# EAGLE schematic BigFish_Rev1 (EAGLE 7.7.0)

## Sheet 1 of 6: Pots & analog mux
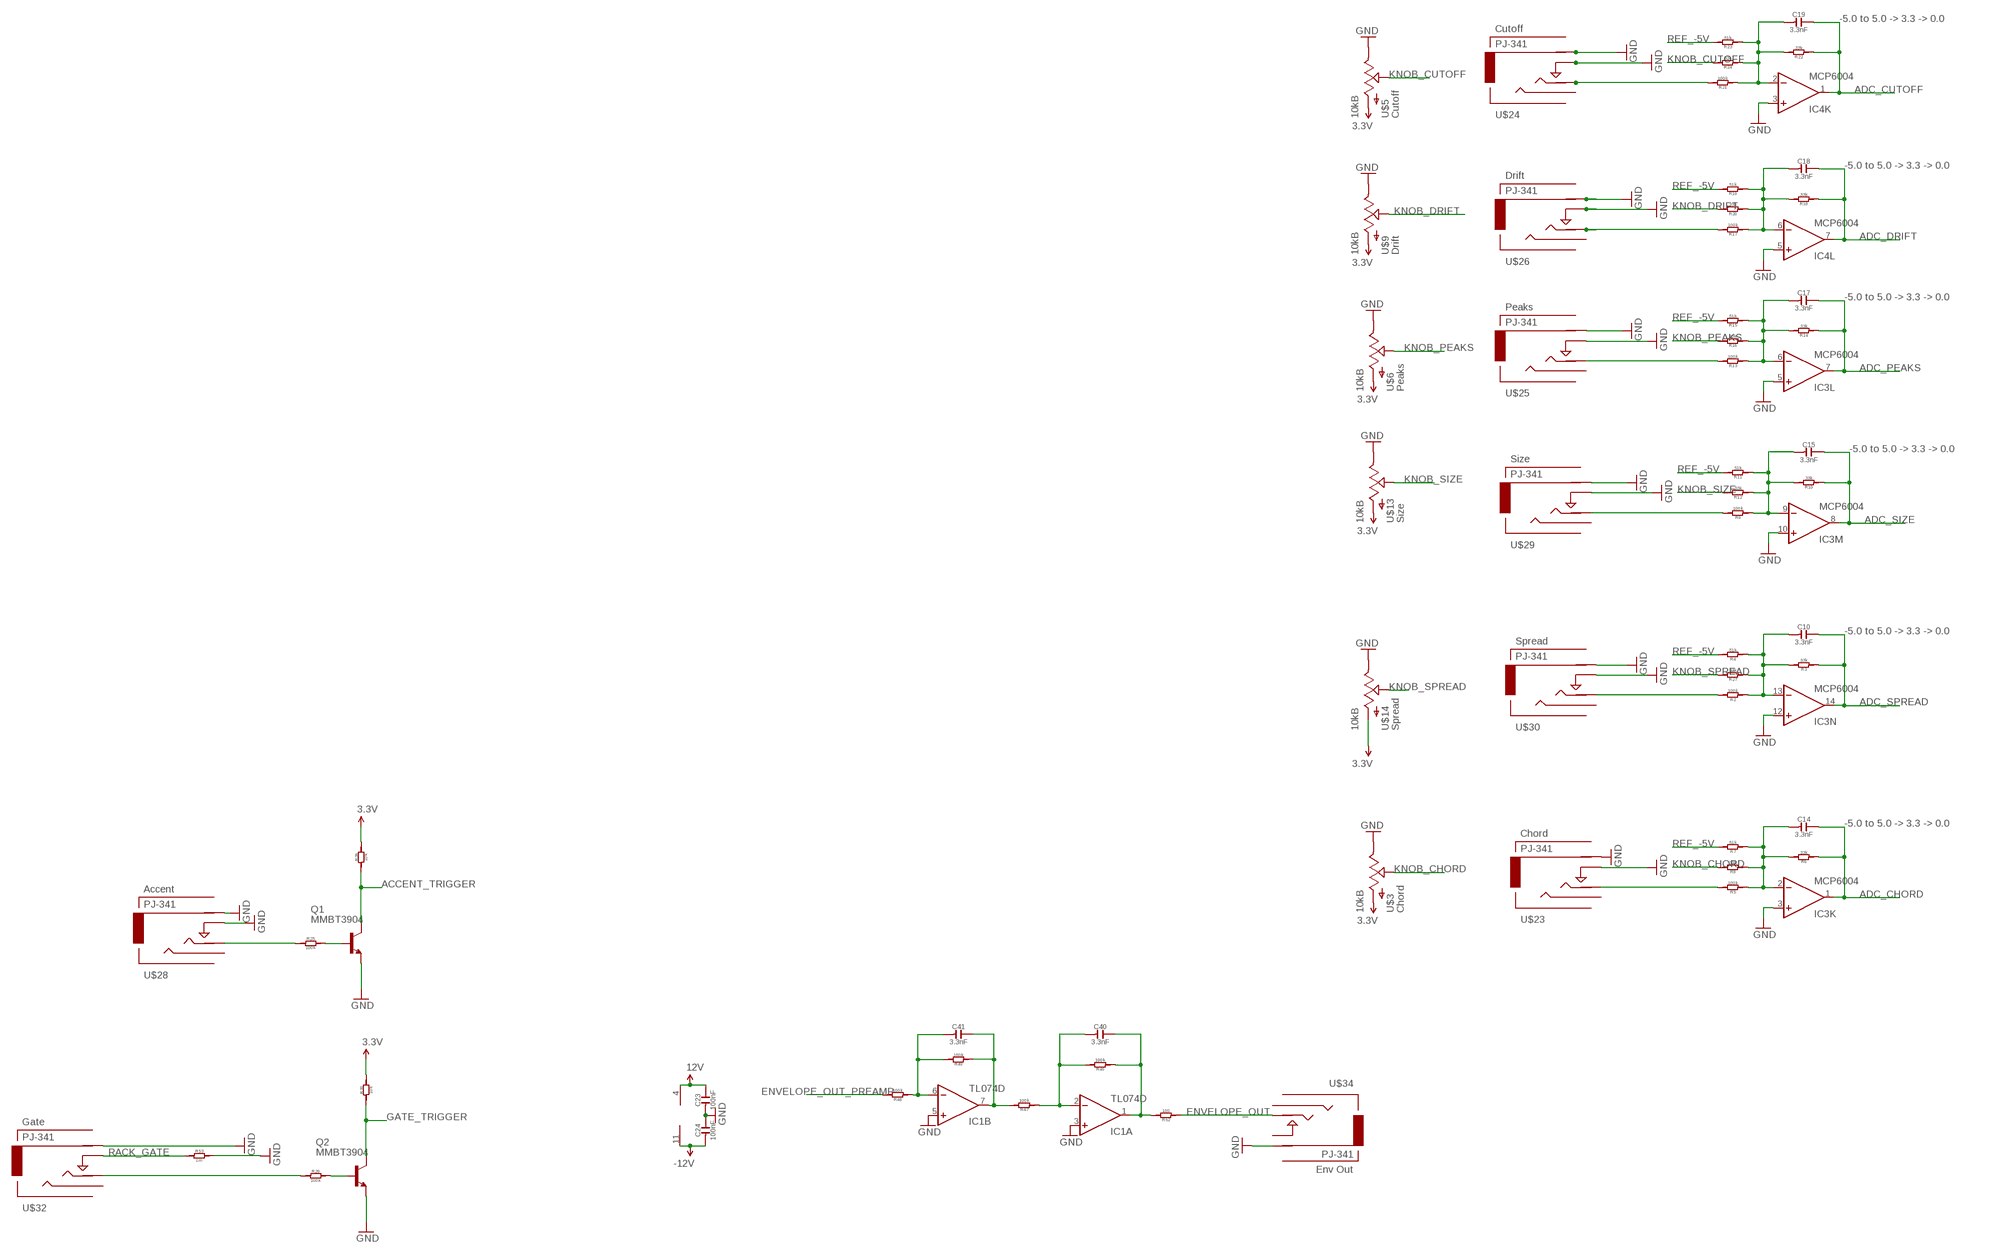
[diagram p0: schematic, sheet 1, part 1 of 2]
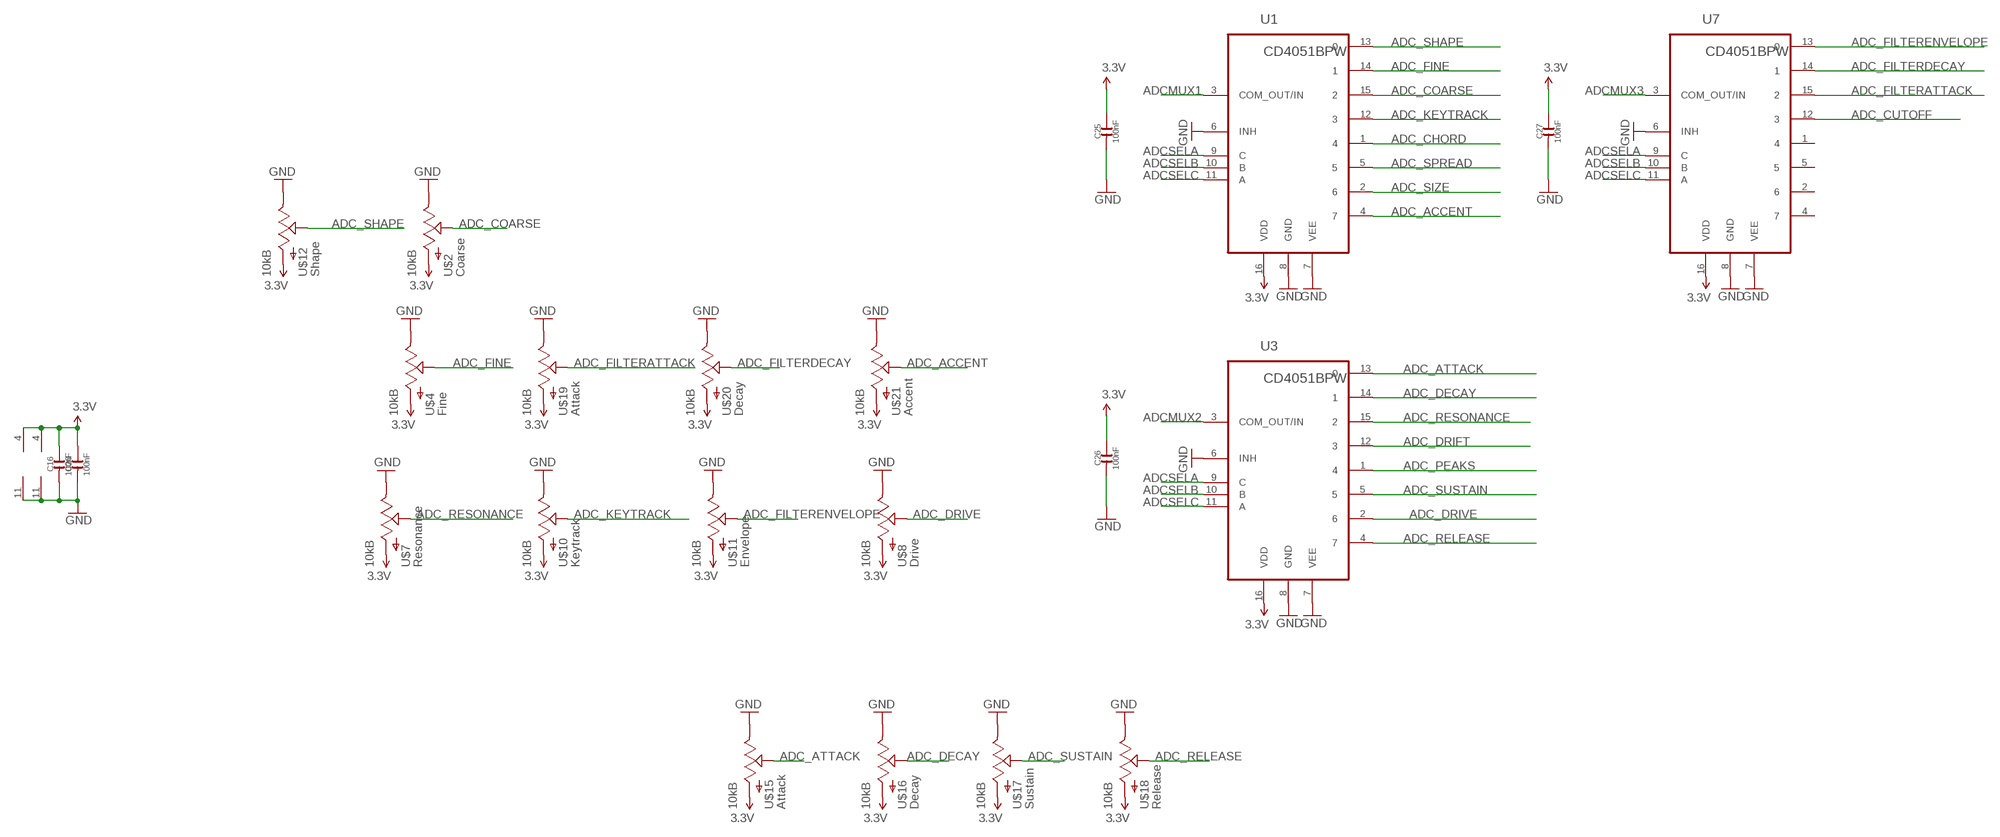
[diagram p1: schematic, sheet 1, part 2 of 2]

### Parts
C10  3.3nF  C-0603  [C0603]
C14  3.3nF  C-0603  [C0603]
C15  3.3nF  C-0603  [C0603]
C16  100nF  C-0603  [C0603]
C17  3.3nF  C-0603  [C0603]
C18  3.3nF  C-0603  [C0603]
C19  3.3nF  C-0603  [C0603]
C20  100nF  C-0603  [C0603]
C23  100nF  C-0603  [C0603]
C24  100nF  C-0603  [C0603]
C25  100nF  C-0603  [C0603]
C26  100nF  C-0603  [C0603]
C27  100nF  C-0603  [C0603]
C40  3.3nF  C-0603  [C0603]
C41  3.3nF  C-0603  [C0603]
IC1  TL074D  [SO14]
IC3  MCP6004  [SO14]
IC4  MCP6004  [SO14]
Q1  MMBT3904  MMBT3904LT1-NPN-SOT23-BEC  [SOT23-BEC]
Q2  MMBT3904  MMBT3904LT1-NPN-SOT23-BEC  [SOT23-BEC]
R2  100k  R-0603  [R0603]
R3  33k  R-0603  [R0603]
R4  51k  R-0603  [R0603]
R5  100k  R-0603  [R0603]
R6  33k  R-0603  [R0603]
R7  51k  R-0603  [R0603]
R8  33k  R-0603  [R0603]
R9  100k  R-0603  [R0603]
R10  33k  R-0603  [R0603]
R11  51k  R-0603  [R0603]
R12  33k  R-0603  [R0603]
R13  100k  R-0603  [R0603]
R14  33k  R-0603  [R0603]
R15  51k  R-0603  [R0603]
R16  33k  R-0603  [R0603]
R17  100k  R-0603  [R0603]
R18  33k  R-0603  [R0603]
R19  51k  R-0603  [R0603]
R20  33k  R-0603  [R0603]
R21  100k  R-0603  [R0603]
R22  33k  R-0603  [R0603]
R23  51k  R-0603  [R0603]
R24  33k  R-0603  [R0603]
R25  100k  R-0603  [R0603]
R27  33k  R-0603  [R0603]
R28  10k  R-0603  [R0603]
R29  100k  R-0603  [R0603]
R30  10k  R-0603  [R0603]
R46  100k  R-0603  [R0603]
R47  100k  R-0603  [R0603]
R48  100k  R-0603  [R0603]
R49  100k  R-0603  [R0603]
R52  100  R-0603  [R0603]
R53  1m  R-0603  [R0603]
U1  CD4051BPW  [SOP65P640X120-16N]
U3  CD4051BPW  [SOP65P640X120-16N]
U7  CD4051BPW  [SOP65P640X120-16N]
U$2  10kB  POTZEPHPOT  [OG-POTS_ALPS_POT_VERTICAL]
U$3  10kB  POTZEPHPOT  [OG-POTS_ALPS_POT_VERTICAL]
U$4  10kB  POTZEPHPOT  [OG-POTS_ALPS_POT_VERTICAL]
U$5  10kB  POTZEPHPOT  [OG-POTS_ALPS_POT_VERTICAL]
U$6  10kB  POTZEPHPOT  [OG-POTS_ALPS_POT_VERTICAL]
U$7  10kB  POTZEPHPOT  [OG-POTS_ALPS_POT_VERTICAL]
U$8  10kB  POTZEPHPOT  [OG-POTS_ALPS_POT_VERTICAL]
U$9  10kB  POTZEPHPOT  [OG-POTS_ALPS_POT_VERTICAL]
U$10  10kB  POTZEPHPOT  [OG-POTS_ALPS_POT_VERTICAL]
U$11  10kB  POTZEPHPOT  [OG-POTS_ALPS_POT_VERTICAL]
U$12  10kB  POTZEPHPOT  [OG-POTS_ALPS_POT_VERTICAL]
U$13  10kB  POTZEPHPOT  [OG-POTS_ALPS_POT_VERTICAL]
U$14  10kB  POTZEPHPOT  [OG-POTS_ALPS_POT_VERTICAL]
U$15  10kB  POTZEPHPOT  [OG-POTS_ALPS_POT_VERTICAL]
U$16  10kB  POTZEPHPOT  [OG-POTS_ALPS_POT_VERTICAL]
U$17  10kB  POTZEPHPOT  [OG-POTS_ALPS_POT_VERTICAL]
U$18  10kB  POTZEPHPOT  [OG-POTS_ALPS_POT_VERTICAL]
U$19  10kB  POTZEPHPOT  [OG-POTS_ALPS_POT_VERTICAL]
U$20  10kB  POTZEPHPOT  [OG-POTS_ALPS_POT_VERTICAL]
U$21  10kB  POTZEPHPOT  [OG-POTS_ALPS_POT_VERTICAL]
U$23  PJ-341  AUDIO-JACKINPUT  [3.5MM-JACK-SWITCH-13MM-INPUT]
U$24  PJ-341  AUDIO-JACKINPUT  [3.5MM-JACK-SWITCH-13MM-INPUT]
U$25  PJ-341  AUDIO-JACKINPUT  [3.5MM-JACK-SWITCH-13MM-INPUT]
U$26  PJ-341  AUDIO-JACKINPUT  [3.5MM-JACK-SWITCH-13MM-INPUT]
U$28  PJ-341  AUDIO-JACKINPUT  [3.5MM-JACK-SWITCH-13MM-INPUT]
U$29  PJ-341  AUDIO-JACKINPUT  [3.5MM-JACK-SWITCH-13MM-INPUT]
U$30  PJ-341  AUDIO-JACKINPUT  [3.5MM-JACK-SWITCH-13MM-INPUT]
U$32  PJ-341  AUDIO-JACKINPUT  [3.5MM-JACK-SWITCH-13MM-INPUT]
U$34  PJ-341  AUDIO-JACKOUTPUT  [3.5MM-JACK-SWITCH-13MM-OUTPUT]

### Nets
3.3V [mediumpower]: C16.2 C20.2 C25.2 C26.2 C27.2 IC3.4(O:V+) IC4.4(O:V+) R28.2 R30.2 U1.16(VDD) U3.16(VDD) U7.16(VDD) U$2.P$3(A) U$3.P$3(A) U$4.P$3(A) U$5.P$3(A) U$6.P$3(A) U$7.P$3(A) U$8.P$3(A) U$9.P$3(A) U$10.P$3(A) U$11.P$3(A) U$12.P$3(A) U$13.P$3(A) U$14.P$3(A) U$15.P$3(A) U$16.P$3(A) U$17.P$3(A) U$18.P$3(A) U$19.P$3(A) U$20.P$3(A) U$21.P$3(A) ; also sheet 2,3,5,6
12V [heavypower]: C23.2 IC1.4(P:V+) ; also sheet 3,5
-12V [heavypower]: C24.1 IC1.11(P:V-) ; also sheet 3,5
ACCENT_TRIGGER: Q1.C R28.1 ; also sheet 2
ADC_ACCENT: U1.4 U$21.P$2(S)
ADC_ATTACK: U3.13 U$15.P$2(S)
ADC_CHORD: C14.2 IC3.1(K:OUT) R6.1 U1.1
ADC_COARSE: U1.15 U$2.P$2(S)
ADC_CUTOFF: C19.2 IC4.1(K:OUT) R22.1 U7.12
ADC_DECAY: U3.14 U$16.P$2(S)
ADC_DRIFT: C18.2 IC4.7(L:OUT) R18.1 U3.12
ADC_DRIVE: U3.2 U$8.P$2(S)
ADC_FILTERATTACK: U7.15 U$19.P$2(S)
ADC_FILTERDECAY: U7.14 U$20.P$2(S)
ADC_FILTERENVELOPE: U7.13 U$11.P$2(S)
ADC_FINE: U1.14 U$4.P$2(S)
ADC_KEYTRACK: U1.12 U$10.P$2(S)
ADC_PEAKS: C17.2 IC3.7(L:OUT) R14.1 U3.1
ADC_RELEASE: U3.4 U$18.P$2(S)
ADC_RESONANCE: U3.15 U$7.P$2(S)
ADC_SHAPE: U1.13 U$12.P$2(S)
ADC_SIZE: C15.2 IC3.8(M:OUT) R10.1 U1.2
ADC_SPREAD: C10.2 IC3.14(N:OUT) R3.1 U1.5
ADC_SUSTAIN: U3.5 U$17.P$2(S)
ADCMUX1: U1.3(COM_OUT/IN) ; also sheet 2
ADCMUX2: U3.3(COM_OUT/IN) ; also sheet 2
ADCMUX3: U7.3(COM_OUT/IN) ; also sheet 2
ADCSELA: U1.9(C) U3.9(C) U7.9(C) ; also sheet 2
ADCSELB: U1.10(B) U3.10(B) U7.10(B) ; also sheet 2
ADCSELC: U1.11(A) U3.11(A) U7.11(A) ; also sheet 2
ENVELOPE_OUT: R52.1 U$34.TIP@3(TIP)
ENVELOPE_OUT_PREAMP: R48.2 ; also sheet 2
GATE_TRIGGER: Q2.C R30.1 ; also sheet 2
GND: C16.1 C20.1 C23.1 C24.2 C25.1 C26.1 C27.1 IC1.3(A:+IN) IC1.5(B:+IN) IC3.3(K:+IN) IC3.5(L:+IN) IC3.10(M:+IN) IC3.11(O:V-) IC3.12(N:+IN) IC4.3(K:+IN) IC4.5(L:+IN) IC4.11(O:V-) Q1.E Q2.E R53.2 U1.6(INH) U1.7(VEE) U1.8(GND) U3.6(INH) U3.7(VEE) U3.8(GND) U7.6(INH) U7.7(VEE) U7.8(GND) U$2.P$1(E) U$3.P$1(E) U$4.P$1(E) U$5.P$1(E) U$6.P$1(E) U$7.P$1(E) U$8.P$1(E) U$9.P$1(E) U$10.P$1(E) U$11.P$1(E) U$12.P$1(E) U$13.P$1(E) U$14.P$1(E) U$15.P$1(E) U$16.P$1(E) U$17.P$1(E) U$18.P$1(E) U$19.P$1(E) U$20.P$1(E) U$21.P$1(E) U$23.RING@3(RING) U$23.SWITCH@3(SWITCH) U$24.RING@3(RING) U$24.SWITCH@3(SWITCH) U$25.RING@3(RING) U$25.SWITCH@3(SWITCH) U$26.RING@3(RING) U$26.SWITCH@3(SWITCH) U$28.RING@3(RING) U$28.SWITCH@3(SWITCH) U$29.RING@3(RING) U$29.SWITCH@3(SWITCH) U$30.RING@3(RING) U$30.SWITCH@3(SWITCH) U$32.RING@3(RING) U$34.RING@3(RING) ; also sheet 2,3,5,6
KNOB_CHORD: R8.2 U$3.P$2(S)
KNOB_CUTOFF: R24.2 U$5.P$2(S)
KNOB_DRIFT: R20.2 U$9.P$2(S)
KNOB_PEAKS: R16.2 U$6.P$2(S)
KNOB_SIZE: R12.2 U$13.P$2(S)
KNOB_SPREAD: R27.2 U$14.P$2(S)
N$3: R17.2 U$26.TIP@3(TIP)
N$4: C18.1 IC4.6(L:-IN) R17.1 R18.2 R19.1 R20.1
N$5: R21.2 U$24.TIP@3(TIP)
N$6: R2.2 U$30.TIP@3(TIP)
N$7: C19.1 IC4.2(K:-IN) R21.1 R22.2 R23.1 R24.1
N$8: C10.1 IC3.13(N:-IN) R2.1 R3.2 R4.1 R27.1
N$9: Q1.B R25.2
N$10: R25.1 U$28.TIP@3(TIP)
N$11: Q2.B R29.2
N$12: R5.2 U$23.TIP@3(TIP)
N$14: C14.1 IC3.2(K:-IN) R5.1 R6.2 R7.1 R8.1
N$15: R9.2 U$29.TIP@3(TIP)
N$16: C15.1 IC3.9(M:-IN) R9.1 R10.2 R11.1 R12.1
N$17: R13.2 U$25.TIP@3(TIP)
N$18: C17.1 IC3.6(L:-IN) R13.1 R14.2 R15.1 R16.1
N$19: R29.1 U$32.TIP@3(TIP)
N$47: C40.2 IC1.1(A:OUT) R46.1 R52.2
N$54: C41.1 IC1.6(B:-IN) R48.1 R49.2
N$55: C41.2 IC1.7(B:OUT) R47.2 R49.1
N$56: C40.1 IC1.2(A:-IN) R46.2 R47.1
RACK_GATE: R53.1 U$32.SWITCH@3(SWITCH) ; also sheet 3
REF_-5V: R4.2 R7.2 R11.2 R15.2 R19.2 R23.2 ; also sheet 3,5
Unconnected: U7.1 U7.2 U7.4 U7.5 U$23.SECOND@3(SECOND) U$24.SECOND@3(SECOND) U$25.SECOND@3(SECOND) U$26.SECOND@3(SECOND) U$28.SECOND@3(SECOND) U$29.SECOND@3(SECOND) U$30.SECOND@3(SECOND) U$32.SECOND@3(SECOND) U$34.SECOND@3(SECOND) U$34.SWITCH@3(SWITCH)

### Notes on the sheet
- -5.0 to 5.0 -> 3.3 -> 0.0
- -5.0 to 5.0 -> 3.3 -> 0.0
- -5.0 to 5.0 -> 3.3 -> 0.0
- -5.0 to 5.0 -> 3.3 -> 0.0
- -5.0 to 5.0 -> 3.3 -> 0.0
- -5.0 to 5.0 -> 3.3 -> 0.0

## Sheet 2 of 6: MCU
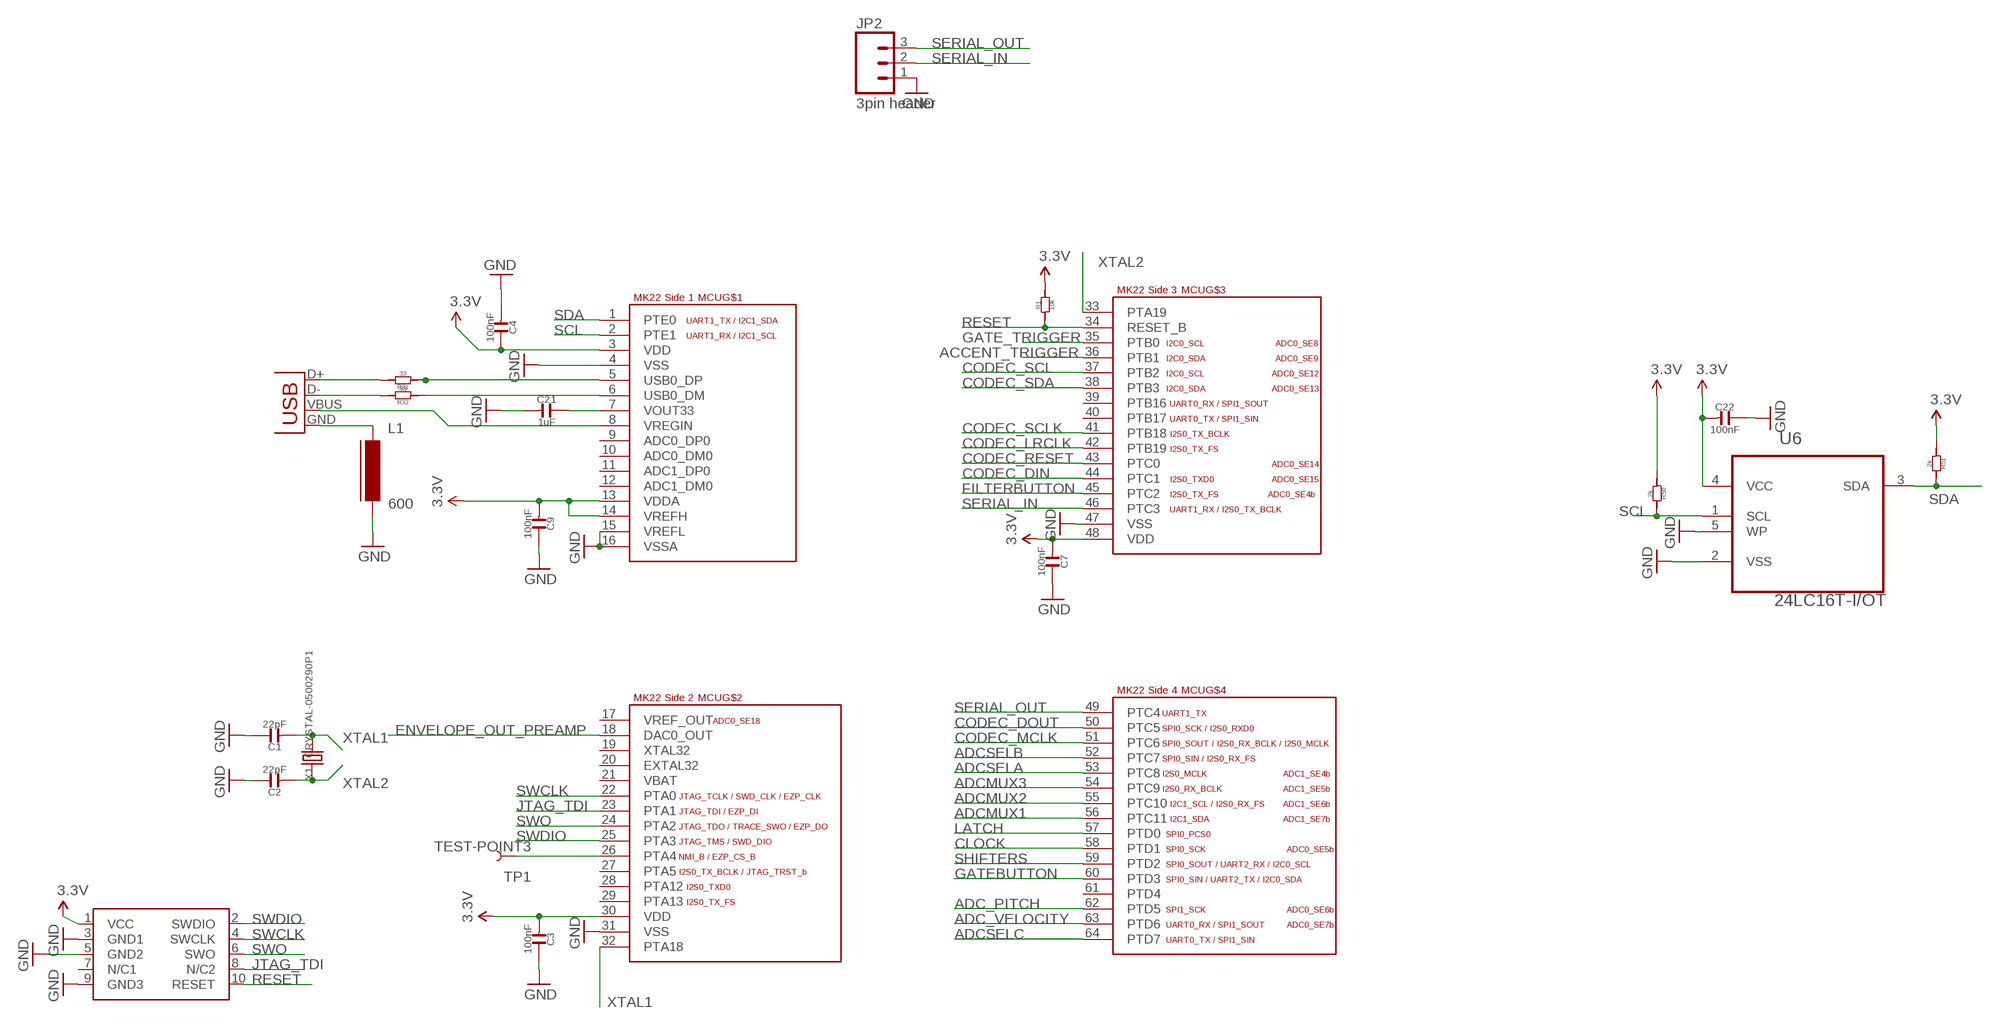
[diagram p2: schematic, sheet 2]

### Parts
C1  22pF  C-0603  [C0603]
C2  22pF  C-0603  [C0603]
C3  100nF  C-0603  [C0603]
C4  100nF  C-0603  [C0603]
C7  100nF  C-0603  [C0603]
C9  100nF  C-0603  [C0603]
C21  1uF  C-0603  [C0603]
C22  100nF  C-0603  [C0603]
JP1  USBPTH-VERTICAL  [USB-B-PTH-VERTICAL]
JP2  3pin header  M03PTH  [1X03]
L1  600  FERRITE-0603  [FB603]
MCU  MK22_120_TQFP64  [MK22_TQFP64]
R1  10k  R-0603  [R0603]
R31  33  R-0603  [R0603]
R32  33  R-0603  [R0603]
R50  2k  R-0603  [R0603]
R51  2k  R-0603  [R0603]
SWD1  CORTEX_SWD  [M50-3600542]
TP1  TEST-POINT3  [PAD.03X.03]
U6  24LC16T-I/OT  24LC00T-I/OT  [SOT95P290X145-5N]
X1  CRYSTAL-0500290P1  [2P-SMD-5.0X3.2]

### Nets
3.3V [mediumpower]: C3.1 C4.2 C7.1 C9.1 C22.1 MCU.3(VDD) MCU.13(VDDA) MCU.14(VREFH) MCU.30(VDD) MCU.48(VDD) R1.2 R50.1 R51.1 SWD1.1(VCC) U6.4(VCC) ; also sheet 1,3,5,6
ACCENT_TRIGGER: MCU.36(PTB1) ; also sheet 1
ADC_PITCH: MCU.62(PTD5) ; also sheet 5
ADC_VELOCITY: MCU.63(PTD6) ; also sheet 5
ADCMUX1: MCU.56(PTC11) ; also sheet 1
ADCMUX2: MCU.55(PTC10) ; also sheet 1
ADCMUX3: MCU.54(PTC9) ; also sheet 1
ADCSELA: MCU.53(PTC8) ; also sheet 1
ADCSELB: MCU.52(PTC7) ; also sheet 1
ADCSELC: MCU.64(PTD7) ; also sheet 1
CLOCK: MCU.58(PTD1) ; also sheet 6
CODEC_DIN: MCU.44(PTC1) ; also sheet 5
CODEC_DOUT: MCU.50(PTC5) ; also sheet 5
CODEC_LRCLK: MCU.42(PTB19) ; also sheet 5
CODEC_MCLK: MCU.51(PTC6) ; also sheet 5
CODEC_RESET: MCU.43(PTC0) ; also sheet 5
CODEC_SCL: MCU.37(PTB2) ; also sheet 5
CODEC_SCLK: MCU.41(PTB18) ; also sheet 5
CODEC_SDA: MCU.38(PTB3) ; also sheet 5
ENVELOPE_OUT_PREAMP: MCU.18(DAC0_OUT) ; also sheet 1
FILTERBUTTON: MCU.45(PTC2) ; also sheet 6
GATE_TRIGGER: MCU.35(PTB0) ; also sheet 1
GATEBUTTON: MCU.60(PTD3) ; also sheet 6
GND: C1.2 C2.2 C3.2 C4.1 C7.2 C9.2 C21.1 C22.2 JP2.1 L1.2 MCU.4(VSS) MCU.15(VREFL) MCU.16(VSSA) MCU.31(VSS) MCU.47(VSS) SWD1.3(GND1) SWD1.5(GND2) SWD1.9(GND3) U6.2(VSS) U6.5(WP) ; also sheet 1,3,5,6
JTAG_TDI: MCU.23(PTA1) SWD1.8(N/C2)
LATCH: MCU.57(PTD0) ; also sheet 6
N$20: C21.2 MCU.7(VOUT33)
N$21: JP1.D+ R31.2
N$22: JP1.D- R32.2
N$23 [mediumpower]: JP1.VBUS MCU.8(VREGIN)
N$24: MCU.5(USB0_DP) R31.1
N$25: MCU.6(USB0_DM) R32.1
N$26 [heavypower]: JP1.GND L1.1
N$57: MCU.26(PTA4) TP1.P$1
RESET: MCU.34(RESET_B) R1.1 SWD1.10(RESET)
SCL: MCU.2(PTE1) R50.2 U6.1(SCL)
SDA: MCU.1(PTE0) R51.2 U6.3(SDA)
SERIAL_IN: JP2.2 MCU.46(PTC3)
SERIAL_OUT: JP2.3 MCU.49(PTC4)
SHIFTERS: MCU.59(PTD2) ; also sheet 6
SWCLK: MCU.22(PTA0) SWD1.4(SWCLK)
SWDIO: MCU.25(PTA3) SWD1.2(SWDIO)
SWO: MCU.24(PTA2) SWD1.6(SWO)
XTAL1: C1.1 MCU.32(PTA18) X1.2
XTAL2: C2.1 MCU.33(PTA19) X1.1
Unconnected: MCU.9(ADC0_DP0) MCU.10(ADC0_DM0) MCU.11(ADC1_DP0) MCU.12(ADC1_DM0) MCU.17(VREF_OUT) MCU.19(XTAL32) MCU.20(EXTAL32) MCU.21(VBAT) MCU.27(PTA5) MCU.28(PTA12) MCU.29(PTA13) MCU.39(PTB16) MCU.40(PTB17) MCU.61(PTD4) SWD1.7(N/C1)

## Sheet 3 of 6: Power
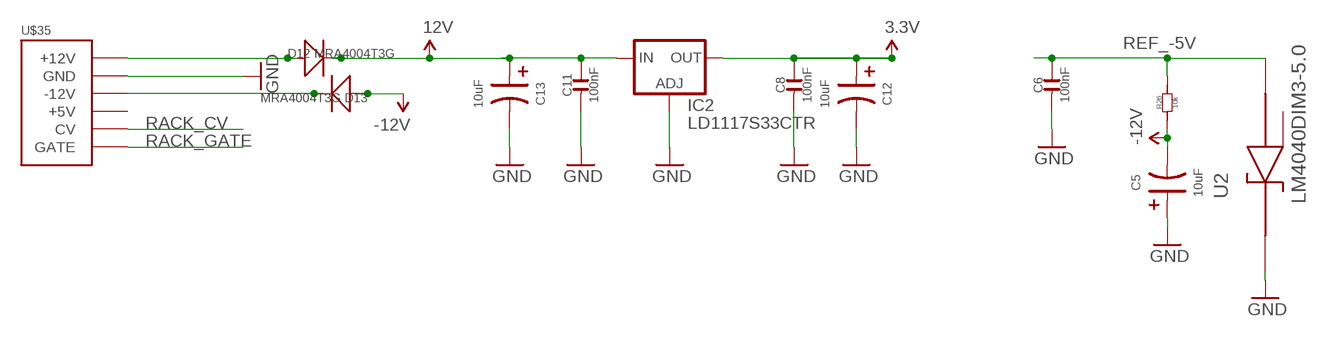
[diagram p3: schematic, sheet 3]

### Parts
C5  10uF  C-POLAR-A  [AVX-A]
C6  100nF  C-0603  [C0603]
C8  100nF  C-0603  [C0603]
C11  100nF  C-0603  [C0603]
C12  10uF  C-POLAR-A  [AVX-A]
C13  10uF  C-POLAR-A  [AVX-A]
D12  MRA4004T3G  D-SMA  [DO-214AC]
D13  MRA4004T3G  D-SMA  [DO-214AC]
IC2  LD1117S33CTR  LD1117AS33TR  [SOT223]
R26  10k  R-0603  [R0603]
U2  LM4040DIM3-5.0  [SOT95P237X112-3N]
U$35  POWERSMT  [2X08_SMT_HEADER]

### Nets
3.3V [mediumpower]: C8.2 C12.+ IC2.2(OUT) IC2.4(OUT) ; also sheet 1,2,5,6
12V [heavypower]: C11.2 C13.+ D12.2(-) IC2.3(IN) ; also sheet 1,5
-12V [heavypower]: C5.- D13.1(+) R26.1 ; also sheet 1,5
GND: C5.+ C6.1 C8.1 C11.1 C12.- C13.- IC2.1(ADJ) U2.1(CATHODE) U$35.3(GND) U$35.4(GND) U$35.5(GND) U$35.6(GND) U$35.7(GND) U$35.8(GND) ; also sheet 1,2,5,6
N$13 [heavypower]: D12.1(+) U$35.9(+12V) U$35.10(+12V)
N$64 [heavypower]: D13.2(-) U$35.1(-12V) U$35.2(-12V)
RACK_CV: U$35.13(CV) U$35.14(CV) ; also sheet 5
RACK_GATE: U$35.15(GATE) U$35.16(GATE) ; also sheet 1
REF_-5V: C6.2 R26.2 U2.2(ANODE) ; also sheet 1,5
Unconnected: U2.3(NC) U$35.11(+5V) U$35.12(+5V)

## Sheet 4 of 6: Cosmetic
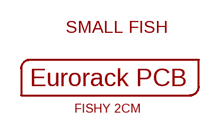
[diagram p4: schematic, sheet 4]

### Parts
U$1  EURORACK_PCB24HP  [EURORACK24HPPCB]
U$45  FISH2CM  [FISH]
U$49  FISH_SMALL  [FISH_SMALL]

## Sheet 5 of 6: CODEC
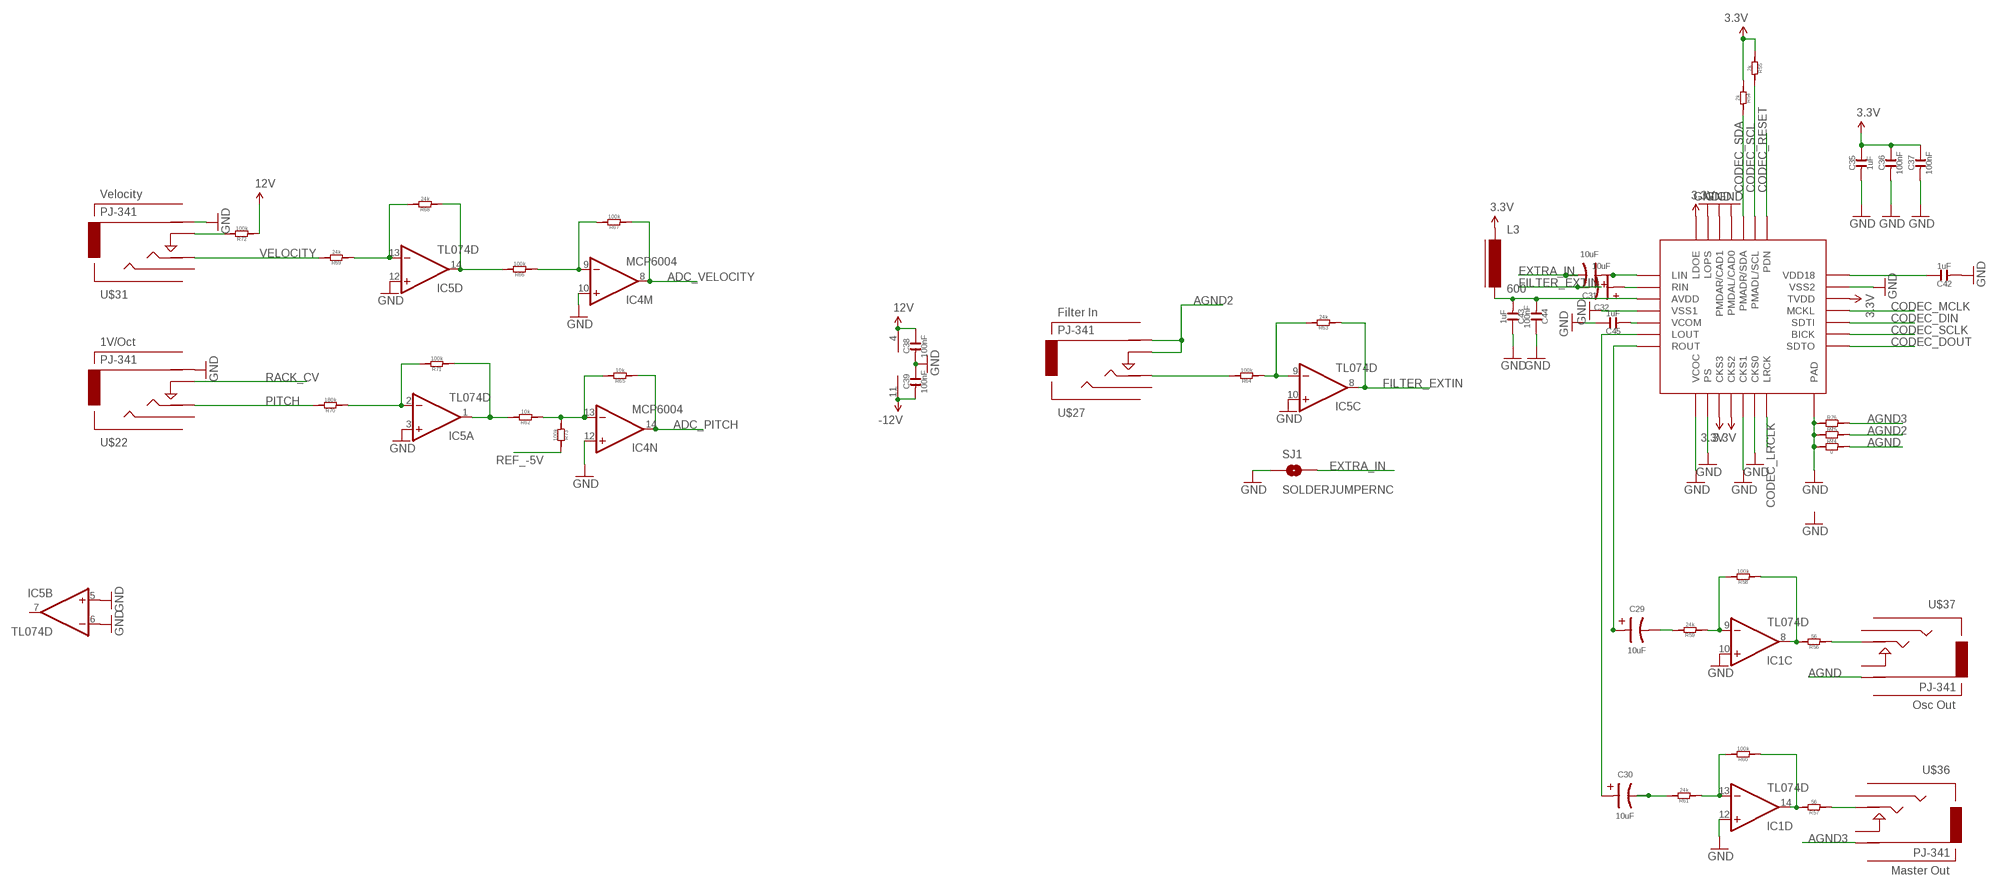
[diagram p5: schematic, sheet 5]

### Parts
C29  10uF  C-POLAR-A  [AVX-A]
C30  10uF  C-POLAR-A  [AVX-A]
C31  10uF  C-POLAR-A  [AVX-A]
C32  10uF  C-POLAR-A  [AVX-A]
C35  1uF  C-0603  [C0603]
C36  100nF  C-0603  [C0603]
C37  100nF  C-0603  [C0603]
C38  100nF  C-0603  [C0603]
C39  100nF  C-0603  [C0603]
C42  1uF  C-0603  [C0603]
C43  1uF  C-0603  [C0603]
C44  100nF  C-0603  [C0603]
C45  1uF  C-0603  [C0603]
IC5  TL074D  [SO14]
L3  600  FERRITE-0603  [FB603]
R54  2k  R-0603  [R0603]
R55  2k  R-0603  [R0603]
R56  56  R-0603  [R0603]
R57  56  R-0603  [R0603]
R58  100k  R-0603  [R0603]
R59  24k  R-0603  [R0603]
R60  100k  R-0603  [R0603]
R61  24k  R-0603  [R0603]
R62  10k  R-0603  [R0603]
R63  24k  R-0603  [R0603]
R64  100k  R-0603  [R0603]
R65  10k  R-0603  [R0603]
R66  100k  R-0603  [R0603]
R67  100k  R-0603  [R0603]
R68  24k  R-0603  [R0603]
R69  24k  R-0603  [R0603]
R70  180k  R-0603  [R0603]
R71  100k  R-0603  [R0603]
R72  100k  R-0603  [R0603]
R73  100k  R-0603  [R0603]
R74  0  R-0603  [R0603]
R75  0  R-0603  [R0603]
R76  0  R-0603  [R0603]
SJ1  SOLDERJUMPERNC  [SJ_2S]
U$22  PJ-341  AUDIO-JACKINPUT  [3.5MM-JACK-SWITCH-13MM-INPUT]
U$27  PJ-341  AUDIO-JACKINPUT  [3.5MM-JACK-SWITCH-13MM-INPUT]
U$31  PJ-341  AUDIO-JACKINPUT  [3.5MM-JACK-SWITCH-13MM-INPUT]
U$36  PJ-341  AUDIO-JACKOUTPUT  [3.5MM-JACK-SWITCH-13MM-OUTPUT]
U$37  PJ-341  AUDIO-JACKOUTPUT  [3.5MM-JACK-SWITCH-13MM-OUTPUT]
U$48  AK4558  [QFN28]

### Nets
3.3V [mediumpower]: C35.2 C36.2 C37.2 L3.1 R54.2 R55.2 U$48.P$3(CKS3) U$48.P$4(CKS2) U$48.P$12(TVDD) U$48.P$21(LDOE) ; also sheet 1,2,3,6
3.3VAUDIO1: C43.1 C44.1 L3.2 U$48.P$24(AVDD)
12V [heavypower]: C38.2 IC5.4(P:V+) R72.1 ; also sheet 1,3
-12V [heavypower]: C39.1 IC5.11(P:V-) ; also sheet 1,3
ADC_PITCH: IC4.14(N:OUT) R65.1 ; also sheet 2
ADC_VELOCITY: IC4.8(M:OUT) R67.1 ; also sheet 2
AGND [heavypower]: R74.1 U$37.RING@3(RING)
AGND2 [heavypower]: R75.1 U$27.RING@3(RING) U$27.SWITCH@3(SWITCH)
AGND3 [heavypower]: R76.1 U$36.RING@3(RING)
CODEC_DIN: U$48.P$10(SDTI) ; also sheet 2
CODEC_DOUT: U$48.P$8(SDTO) ; also sheet 2
CODEC_LRCLK: U$48.P$7(LRCK) ; also sheet 2
CODEC_MCLK: U$48.P$11(MCKL) ; also sheet 2
CODEC_RESET: U$48.P$15(PDN) ; also sheet 2
CODEC_SCL: R55.1 U$48.P$16(PMADL/SCL) ; also sheet 2
CODEC_SCLK: U$48.P$9(BICK) ; also sheet 2
CODEC_SDA: R54.1 U$48.P$17(PMADR/SDA) ; also sheet 2
EXTRA_IN: C31.- SJ1.2
FILTER_EXTIN: C32.- IC5.8(C:OUT) R63.1
GND: C35.1 C36.1 C37.1 C38.1 C39.2 C42.1 C43.2 C44.2 C45.2 IC1.10(C:+IN) IC1.12(D:+IN) IC4.10(M:+IN) IC4.12(N:+IN) IC5.3(A:+IN) IC5.5(B:+IN) IC5.6(B:-IN) IC5.10(C:+IN) IC5.12(D:+IN) R74.2 R75.2 R76.2 SJ1.1 U$22.RING@3(RING) U$31.RING@3(RING) U$48.P$1(VCOC) U$48.P$2(PS) U$48.P$5(CKS1) U$48.P$6(CKS0) U$48.P$13(VSS2) U$48.P$18(PMDAL/CAD0) U$48.P$19(PMDAR/CAD1) U$48.P$20(LOPS) U$48.P$25(VSS1) U$48.PAD ; also sheet 1,2,3,6
N$52: C32.+ U$48.P$23(RIN)
N$60: C29.+ U$48.P$28(ROUT)
N$61: C30.+ U$48.P$27(LOUT)
N$63: C31.+ U$48.P$22(LIN)
N$70: R64.2 U$27.TIP@3(TIP)
N$71: IC5.2(A:-IN) R70.1 R71.2
N$72: IC5.1(A:OUT) R62.2 R71.1
N$73: C30.- R61.2
N$74: IC1.8(C:OUT) R56.2 R58.1
N$75: IC1.14(D:OUT) R57.2 R60.1
N$76: IC1.13(D:-IN) R60.2 R61.1
N$77: IC5.13(D:-IN) R68.2 R69.1
N$78: R57.1 U$36.TIP@3(TIP)
N$79: C29.- R59.2
N$80: IC1.9(C:-IN) R58.2 R59.1
N$81: IC5.14(D:OUT) R66.2 R68.1
N$82: R56.1 U$37.TIP@3(TIP)
N$83: IC5.9(C:-IN) R63.2 R64.1
N$84: IC4.13(N:-IN) R62.1 R65.2 R73.1
N$85: IC4.9(M:-IN) R66.1 R67.2
N$86 [heavypower]: R72.2 U$31.SWITCH@3(SWITCH)
N$87: C42.2 U$48.P$14(VDD18)
N$88: C45.1 U$48.P$26(VCOM)
PITCH: R70.2 U$22.TIP@3(TIP)
RACK_CV: U$22.SWITCH@3(SWITCH) ; also sheet 3
REF_-5V: R73.2 ; also sheet 1,3
VELOCITY: R69.2 U$31.TIP@3(TIP)
Unconnected: IC5.7(B:OUT) U$22.SECOND@3(SECOND) U$27.SECOND@3(SECOND) U$31.SECOND@3(SECOND) U$36.SECOND@3(SECOND) U$36.SWITCH@3(SWITCH) U$37.SECOND@3(SECOND) U$37.SWITCH@3(SWITCH)

## Sheet 6 of 6: LEDs and buttons
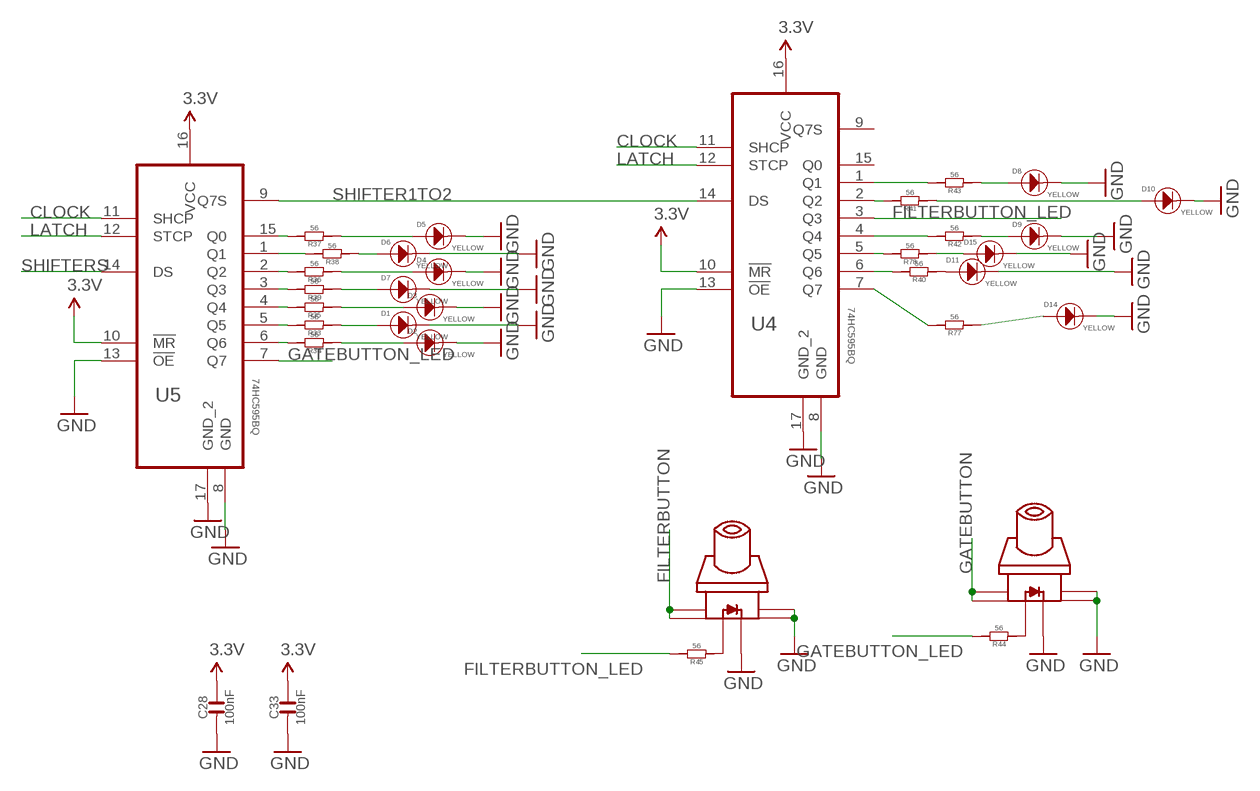
[diagram p6: schematic, sheet 6]

### Parts
C28  100nF  C-0603  [C0603]
C33  100nF  C-0603  [C0603]
D1  YELLOW  LED3MM  [3MMLED]
D2  YELLOW  LED3MM  [3MMLED]
D3  YELLOW  LED3MM  [3MMLED]
D4  YELLOW  LED3MM  [3MMLED]
D5  YELLOW  LED3MM  [3MMLED]
D6  YELLOW  LED3MM  [3MMLED]
D7  YELLOW  LED3MM  [3MMLED]
D8  YELLOW  LED3MM  [3MMLED]
D9  YELLOW  LED3MM  [3MMLED]
D10  YELLOW  LED3MM  [3MMLED]
D11  YELLOW  LED3MM  [3MMLED]
D14  YELLOW  LED  [LED0603]
D15  YELLOW  LED3MM  [3MMLED]
R33  56  R-0603  [R0603]
R34  56  R-0603  [R0603]
R35  56  R-0603  [R0603]
R36  56  R-0603  [R0603]
R37  56  R-0603  [R0603]
R38  56  R-0603  [R0603]
R39  56  R-0603  [R0603]
R40  56  R-0603  [R0603]
R41  56  R-0603  [R0603]
R42  56  R-0603  [R0603]
R43  56  R-0603  [R0603]
R44  56  R-0603  [R0603]
R45  56  R-0603  [R0603]
R77  56  R-0603  [R0603]
R78  56  R-0603  [R0603]
U4  74HC595BQ  [QFN50P250X350X100-17N]
U5  74HC595BQ  [QFN50P250X350X100-17N]
U$38  SWITCH_W_LED_PB6149L-X-102YELLOW  [PB6149L]
U$39  SWITCH_W_LED_PB6149L-X-102YELLOW  [PB6149L]

### Nets
3.3V [mediumpower]: C28.2 C33.2 U4.10(!MR) U4.16(VCC) U5.10(!MR) U5.16(VCC) ; also sheet 1,2,3,5
CLOCK: U4.11(SHCP) U5.11(SHCP) ; also sheet 2
FILTERBUTTON: U$39.1 U$39.2 ; also sheet 2
FILTERBUTTON_LED: R45.2 U4.3(Q3)
GATEBUTTON: U$38.1 U$38.2 ; also sheet 2
GATEBUTTON_LED: R44.2 U5.7(Q7)
GND: C28.1 C33.1 D1.- D2.- D3.- D4.- D5.- D6.- D7.- D8.- D9.- D10.- D11.- D14.- D15.- U4.8(GND) U4.13(!OE) U4.17(GND_2) U5.8(GND) U5.13(!OE) U5.17(GND_2) U$38.3 U$38.4 U$38.LEDNEG(NEG) U$39.3 U$39.4 U$39.LEDNEG(NEG) ; also sheet 1,2,3,5
LATCH: U4.12(STCP) U5.12(STCP) ; also sheet 2
N$27: D1.+ R33.1
N$28: D2.+ R34.1
N$29: D3.+ R35.1
N$30: D4.+ R36.1
N$31: D5.+ R37.1
N$32: D6.+ R38.1
N$33: D7.+ R39.1
N$34: D11.+ R40.1
N$35: D10.+ R41.1
N$36: D9.+ R42.1
N$37: D8.+ R43.1
N$38: R44.1 U$38.LEDPOS(POS)
N$39: R45.1 U$39.LEDPOS(POS)
N$40: R34.2 U5.6(Q6)
N$41: R35.2 U5.4(Q4)
N$42: R33.2 U5.5(Q5)
N$43: R39.2 U5.3(Q3)
N$44: R36.2 U5.2(Q2)
N$45: R37.2 U5.15(Q0)
N$46: R38.2 U5.1(Q1)
N$48: R43.2 U4.1(Q1)
N$49: R42.2 U4.4(Q4)
N$50: R41.2 U4.2(Q2)
N$51: R40.2 U4.6(Q6)
N$53: D14.+ R77.1
N$58: R77.2 U4.7(Q7)
N$59: R78.2 U4.5(Q5)
N$62: D15.+ R78.1
SHIFTER1TO2: U4.14(DS) U5.9(Q7S)
SHIFTERS: U5.14(DS) ; also sheet 2
Unconnected: U4.9(Q7S) U4.15(Q0)

## Library data of the parts
C1-C4 C7 C9 C21 C22 C28 C33 = OPL:C*
C5 C12 C13 C29-C32 = EurorackModularParts:C-POLAR*; MF: AVX; MPN: TAJB106K020RNJ; OC_FARNELL: 197427
C6 = OPL:C*; MF: AVX; MPN: 06035C104KAT2A; OC_FARNELL: 1301804
C8 C11 = OPL:C*; MF: MULTICOMP; MPN: MC0603F104Z160CT; OC_FARNELL: 1759017
C10 C14-C20 C23-C27 C35-C45 = OPL:C*; OC_FARNELL: unknown
D1-D11 D14 D15 = EurorackModularParts:LED*: LED
D12 D13 = OPL:D*: DIODE; MF: VISHAY; MPN: US1G-E3/5AT; OC_FARNELL: 9551824
IC1 IC5 = EurorackModularParts:TL074: OP AMP
IC2 = ld-components:LD1117A?*: Low drop fixed and adjustable positive voltage regulators 1 A Source: http://www.st.com/stonline/products/literature/ds/7194/ld1117axx.pdf; MF: STMICROELECTRONICS; MPN: LD1117AS33TR; OC_FARNELL: 1467776
IC3 IC4 = EurorackModularParts:MCP6004; MF: MICROCHIP; MPN: MCP6004-I/SL.; OC_FARNELL: 1605572
JP1 = SparkFun-Connectors:USB: USB Connectors USB-B-PTH is fully proven SKU : PRT-00139/CONN-08278 USB-miniB is fully proven SKU : PRT-00587 USB-A-PCB is untested. USB-A-H is throughly reviewed, but untested. Spark Fun Electronics SKU : PRT-00437 USB-B-SMT is throughly reviewed, but untested. Needs silkscreen touching up. USB-A-S has not been used/tested USB-MB-H has not been used/tested USB-MICROB has been used. CONN-09505
JP2 = SparkFun-Connectors:M03: Header 3 Standard 3-pin 0.1" header. Use with straight break away headers (SKU : PRT-00116), right angle break away headers (PRT-00553), swiss pins (PRT-00743), machine pins (PRT-00117), and female headers (PRT-00115). Molex polarized connector foot print use with SKU : PRT-08232 with associated crimp pins and housings.
L1 L3 = dp_devices:FERRITE: Ferrite bead in various packages
MCU = EurorackModularParts:MK22_120_TQFP64
Q1 Q2 = transistor:*-NPN-: NPN Transistror BF959 corrected 2008.03.06; MF: NXP; MPN: PMBT3904,215; OC_FARNELL: 2336795
R1 R31 R32 = OPL:R*
R2-R30 R33-R78 = OPL:R*; OC_FARNELL: unknown
SJ1 = SparkFun-Passives:SOLDERJUMPER: Solder Jumper Standard SMD solder jumper. Used to automate production. Two varients : Normally Open and Normally Closed are the same, but have different paste layers. NC will have a large amount of paste and should jumper during reflow.
SWD1 = carrilib with jtags:CORTEX_SWD: .05" Cortex M Connector in SWD mode Manufacturer: Generic Part Number: Cortex M SWD Notes: I use Harwin M50-3600542 connectors
TP1 = SparkFun-Passives:TEST-POINT: Bare copper test points for troubleshooting or ICT
U1 U3 U7 = FarnellThings:CD4051BPW: single 8-Channel multiplexer; MPN: CD4051BPW; OC_FARNELL: 1753421; OC_NEWARK: -; PACKAGE: TSSOP-16; SUPPLIER: Texas Instruments
U2 = FarnellThings:LM4040DIM3-5.0: IC, Precision Micropower Shunt Voltage Reference, 5V,SOT-23-3; MF: TEXAS INSTRUMENTS; MPN: LM4040DIM3-5.0; OC_FARNELL: 9778330; OC_NEWARK: 97K3489; PACKAGE: SOT-23-3; SUPPLIER: TEXAS INSTRUMENTS
U4 U5 = FarnellThings:74HC595BQ: 8-bit serial-in, serial or parallel-out shift register,QFN-16; MF: NXP; MPN: 74HC595BQ; OC_FARNELL: 2164850; OC_NEWARK: 43W8000; PACKAGE: QFN-16; SUPPLIER: NXP
U6 = EurorackModularParts:24LC00T-I/OT: IC, EEPROM 128BIT SERIAL 400KHZ SOT-23-5; MF: MICROCHIP; MPN: 24LC00T-I/OT; OC_FARNELL: 9757864; OC_NEWARK: 62K0574; PACKAGE: SOT-23-5; SUPPLIER: MICROCHIP
U$1 = EurorackModularParts:EURORACK_PCB
U$2 = EurorackModularParts:POT; DESC: Coarse
U$3 = EurorackModularParts:POT; DESC: Chord
U$4 = EurorackModularParts:POT; DESC: Fine
U$5 = EurorackModularParts:POT; DESC: Cutoff
U$6 = EurorackModularParts:POT; DESC: Peaks
U$7 = EurorackModularParts:POT; DESC: Resonance
U$8 = EurorackModularParts:POT; DESC: Drive
U$9 = EurorackModularParts:POT; DESC: Drift
U$10 = EurorackModularParts:POT; DESC: Keytrack
U$11 = EurorackModularParts:POT; DESC: Envelope
U$12 = EurorackModularParts:POT; DESC: Shape
U$13 = EurorackModularParts:POT; DESC: Size
U$14 = EurorackModularParts:POT; DESC: Spread
U$15 U$19 = EurorackModularParts:POT; DESC: Attack
U$16 U$20 = EurorackModularParts:POT; DESC: Decay
U$17 = EurorackModularParts:POT; DESC: Sustain
U$18 = EurorackModularParts:POT; DESC: Release
U$21 = EurorackModularParts:POT; DESC: Accent
U$22 = EurorackModularParts:AUDIO-JACK: Switching Mono 3.5mm Audio Jack from Erthenvar.; DESC: 1V/Oct; MPN: PJ-341
U$23 = EurorackModularParts:AUDIO-JACK: Switching Mono 3.5mm Audio Jack from Erthenvar.; DESC: Chord; MPN: PJ-341
U$24 = EurorackModularParts:AUDIO-JACK: Switching Mono 3.5mm Audio Jack from Erthenvar.; DESC: Cutoff; MPN: PJ-341
U$25 = EurorackModularParts:AUDIO-JACK: Switching Mono 3.5mm Audio Jack from Erthenvar.; DESC: Peaks; MPN: PJ-341
U$26 = EurorackModularParts:AUDIO-JACK: Switching Mono 3.5mm Audio Jack from Erthenvar.; DESC: Drift; MPN: PJ-341
U$27 = EurorackModularParts:AUDIO-JACK: Switching Mono 3.5mm Audio Jack from Erthenvar.; DESC: Filter In; MPN: PJ-341
U$28 = EurorackModularParts:AUDIO-JACK: Switching Mono 3.5mm Audio Jack from Erthenvar.; DESC: Accent; MPN: PJ-341
U$29 = EurorackModularParts:AUDIO-JACK: Switching Mono 3.5mm Audio Jack from Erthenvar.; DESC: Size; MPN: PJ-341
U$30 = EurorackModularParts:AUDIO-JACK: Switching Mono 3.5mm Audio Jack from Erthenvar.; DESC: Spread; MPN: PJ-341
U$31 = EurorackModularParts:AUDIO-JACK: Switching Mono 3.5mm Audio Jack from Erthenvar.; DESC: Velocity; MPN: PJ-341
U$32 = EurorackModularParts:AUDIO-JACK: Switching Mono 3.5mm Audio Jack from Erthenvar.; DESC: Gate; MPN: PJ-341
U$34 = EurorackModularParts:AUDIO-JACK: Switching Mono 3.5mm Audio Jack from Erthenvar.; DESC: Env Out; MPN: PJ-341
U$35 = EurorackModularParts:POWER
U$36 = EurorackModularParts:AUDIO-JACK: Switching Mono 3.5mm Audio Jack from Erthenvar.; DESC: Master Out; MPN: PJ-341
U$37 = EurorackModularParts:AUDIO-JACK: Switching Mono 3.5mm Audio Jack from Erthenvar.; DESC: Osc Out; MPN: PJ-341
U$38 U$39 = zephod-components:SWITCH_W_LED_PB6149L-X-102
U$45 = zephod-components:FISH2CM
U$48 = EurorackModularParts:AK4558
U$49 = zephod-components:FISH_SMALL
X1 = OPL:CRYSTAL*

## Net classes
0 default: width 0.203 mm
1 heavypower: width 0.381 mm
2 mediumpower: width 0.254 mm
3 groundplane: width 0.254 mm, clearance 0.203 mm